# Altium schematic sheet DBG.SchDoc: Debug connectors
size A4; DrawnBy: Grzegorz Gajoch; Address1: Grzegorz Gajoch; Address2: grzegorz@gajoch.pl; Revision: 1
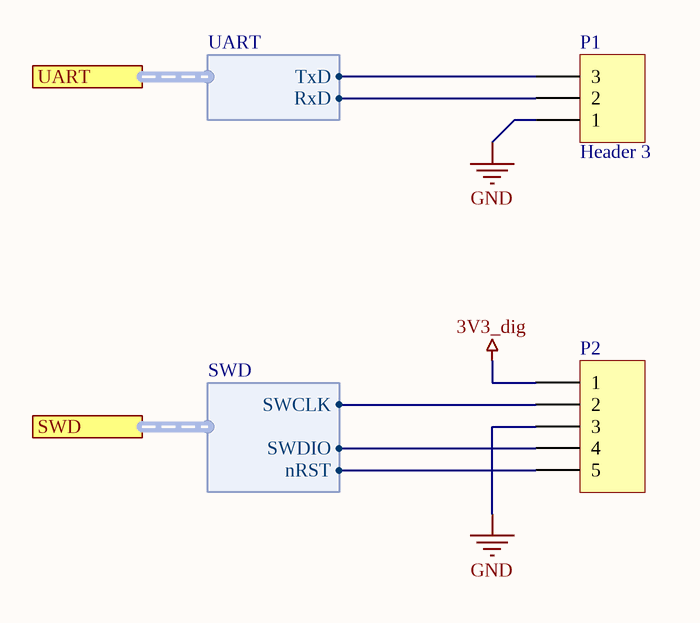
[diagram p0: DBG.SchDoc]

## Parts
P1  Header 3  [HEADER1X3H Male]
P2  Header 5  [HDR1X5]  (value not drawn)

## Ports
SWD (harness SWD), UART (harness UART)

## Harnesses
SWD: SWDIO, SWCLK, nRST
UART: RxD, TxD

## Nets
3V3_dig: P2.1
GND: P1.1 P2.3
NetP1_2: P1.2 ; port UART.RxD
NetP1_3: P1.3 ; port UART.TxD
NetP2_2: P2.2 ; port SWD.SWCLK
NetP2_4: P2.4 ; port SWD.SWDIO
NetP2_5: P2.5 ; port SWD.nRST

## Notes on the sheet
- Title
- Size:
- Date:
- A4
- Number:
- Time:
- Revision:
- Sheet
- of
- File:

## Library data of the parts
P1 = Header 3: Header, 3-Pin; LatestRevisionDate: 17-Jul-2002; LatestRevisionNote: Re-released for DXP Platform.; Publisher: Altium Limited
P2 = Header 5: Header, 5-Pin; LatestRevisionDate: 17-Jul-2002; LatestRevisionNote: Re-released for DXP Platform.; Publisher: Altium Limited